# EAGLE board clock12 (EAGLE 7.7.0)
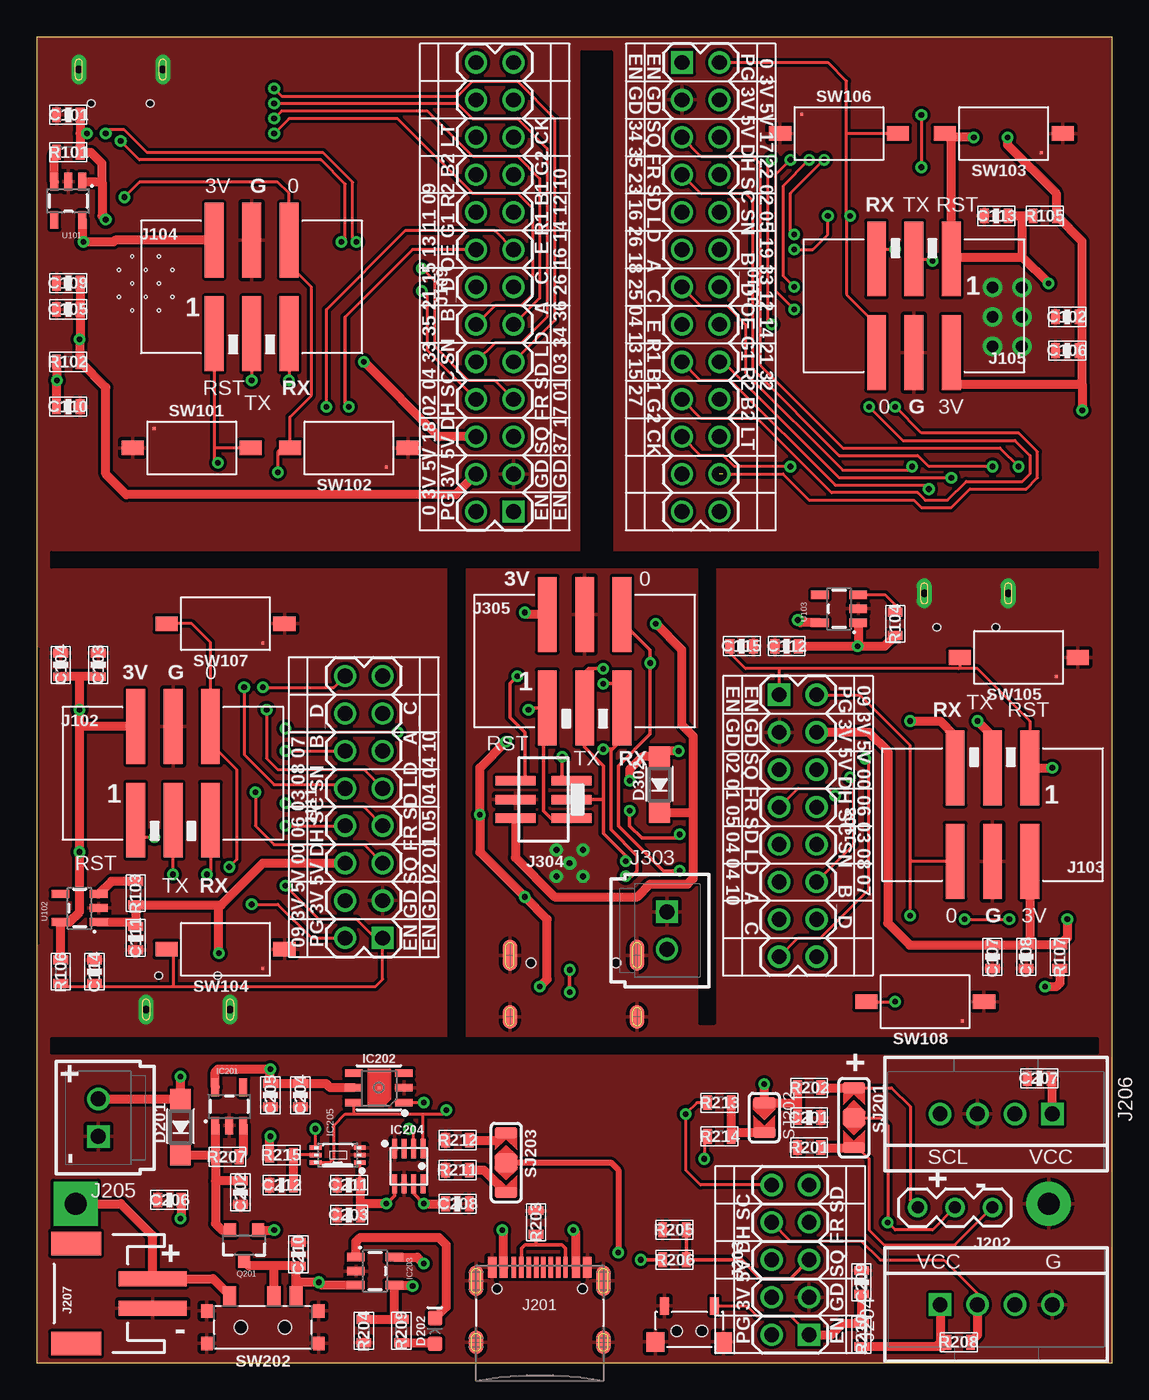
[diagram p3: board, top side]
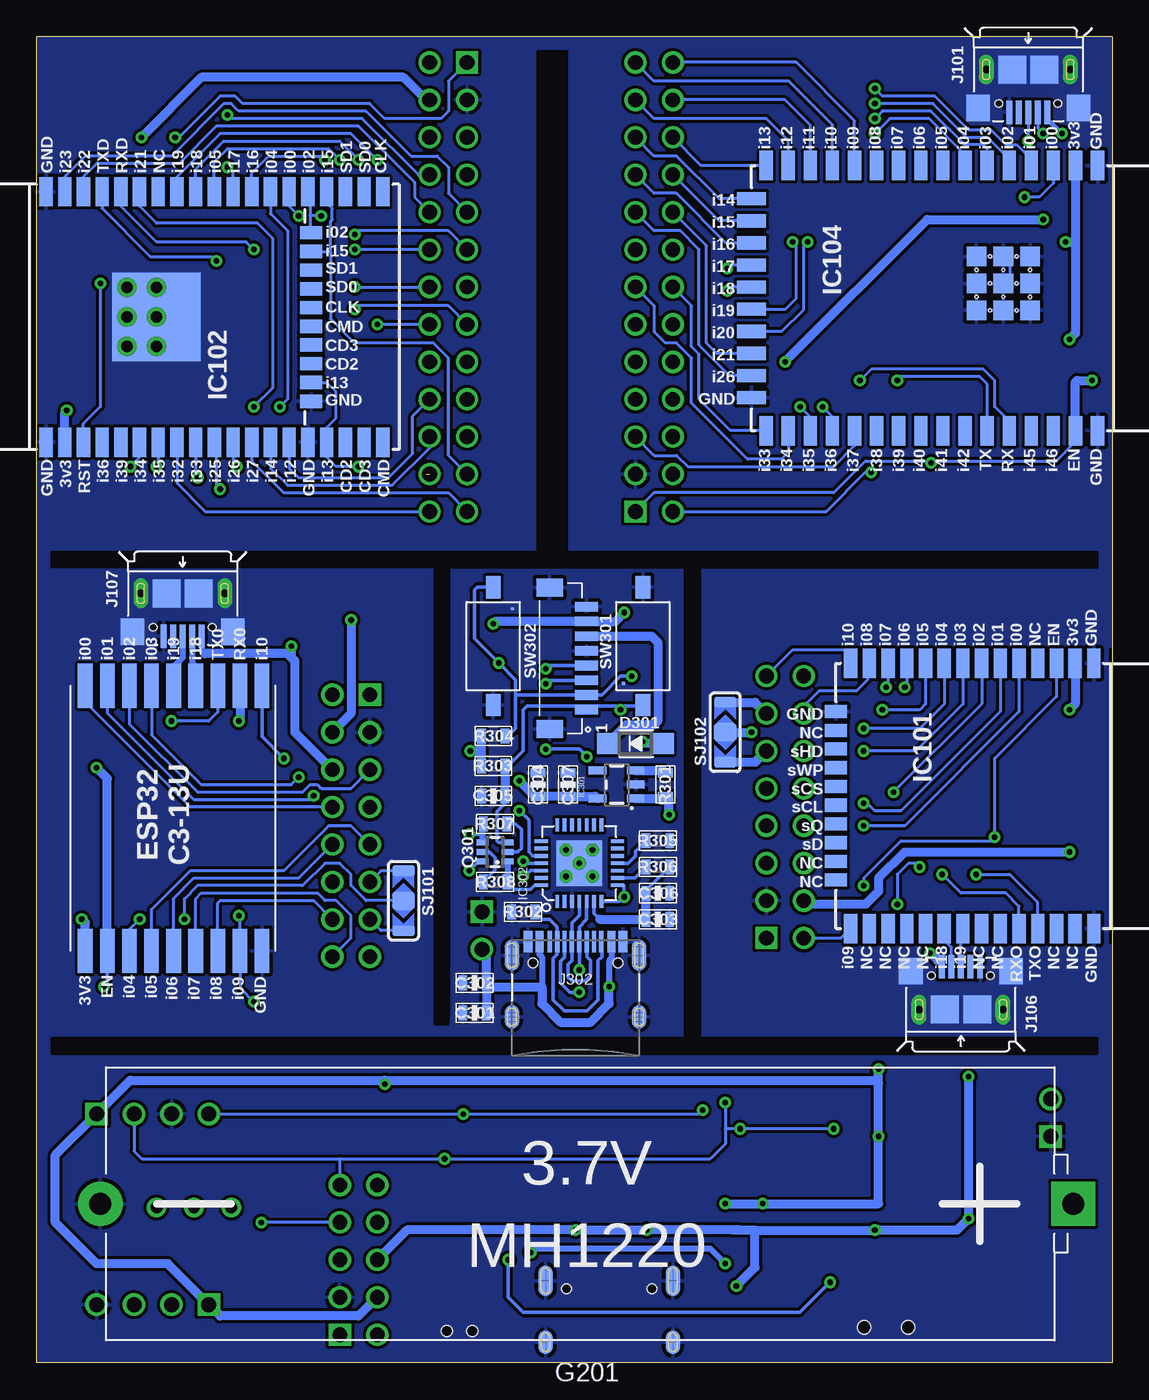
[diagram p4: board, bottom side, seen from below]

Size 73 x 90 mm. Coordinates in mm from the lower left corner, seen from the top.
Outline: 0,90 0,0 73,0 73,90 0,90
Copper layers (1*16): Top 0.035mm / dielectric 1.5mm / Bottom 0.035mm
Design rules "default *": minimum track width 8mil, minimum drill 15mil, track to track 8mil, track to pad 8mil, pad to pad 8mil, via to via 8mil, smd to smd 8mil, copper to edge 1mil, drill to drill 8mil, minimum pad ring 10mil, minimum via ring 8mil, stop-mask expansion 4mil, vias tented up to drill 20mil, thermal gap 10mil
Net classes: 0 default: clearance 0.205 mm; 1 power: width 0.406 mm

## Footprints (pad centres in the part's own frame; a part is rotated, then mirrored left to right if it is on the bottom)
0603-CAP = smd 0.6 x 1: 1 -0.8,0; 2 0.8,0
SOD123 = smd 1.4 x 1.4: A 1.9,0; C -1.9,0
LED-0603 = smd 1 x 1: A -0.877,0; C 0.877,0
BATTERY-LI-MH12210 = drill 1.5 pad 3 square: BAT+ -33.02,0 | drill 1.5 pad 3: BAT- 33.02,0
ESP32C3-S = smd 2 x 0.9: 1 -9,7.5; 2 -9,6.23; 3 -9,4.96; 4 -9,3.69; 5 -9,2.42; 6 -9,1.15; 7 -9,-0.12; 8 -9,-1.39; 9 -9,-2.66; 10 -9,-3.93; 11 -9,-5.2; 12 -9,-6.47; 13 -9,-7.74; 14 -9,-9.01; 25 9,-9.01; 26 9,-7.74; 27 9,-6.47; 28 9,-5.2; 29 9,-3.93; 30 9,-2.66; 31 9,-1.39; 32 9,-0.12; 33 9,1.15; 34 9,2.42; 35 9,3.69; 36 9,4.96; 37 9,6.23; 38 9,7.5 | smd 0.9 x 1.5: 39 -5.725,-10; 40 -4.445,-10; 41 -3.175,-10; 42 -1.905,-10; 43 -0.635,-10; 44 0.635,-10; 45 1.905,-10; 46 3.175,-10; 47 4.445,-10; 48 5.715,-10
ESP32-WROOVER/WROOM = smd 2 x 0.9: 1 -8.5,7.5; 2 -8.5,6.23; 3 -8.5,4.96; 4 -8.5,3.69; 5 -8.5,2.42; 6 -8.5,1.15; 7 -8.5,-0.12; 8 -8.5,-1.39; 9 -8.5,-2.66; 10 -8.5,-3.93; 11 -8.5,-5.2; 12 -8.5,-6.47; 13 -8.5,-7.74; 14 -8.5,-9.01; 15 -8.5,-10.28; 16 -8.5,-11.55; 17 -8.5,-12.82; 18 -8.5,-14.09; 19 -8.5,-15.36; 20 8.5,-15.36; 21 8.5,-14.09; 22 8.5,-12.82; 23 8.5,-11.55; 24 8.5,-10.28; 25 8.5,-9.01; 26 8.5,-7.74; 27 8.5,-6.47; 28 8.5,-5.2; 29 8.5,-3.93; 30 8.5,-2.66; 31 8.5,-1.39; 32 8.5,-0.12; 33 8.5,1.15; 34 8.5,2.42; 35 8.5,3.69; 36 8.5,4.96; 37 8.5,6.23; 38 8.5,7.5 | smd 0.9 x 1.5: 39 -5.725,-10.5; 40 -4.445,-10.5; 41 -3.175,-10.5; 42 -1.905,-10.5; 43 -0.635,-10.5; 44 0.635,-10.5; 45 1.905,-10.5; 46 3.175,-10.5; 47 4.445,-10.5; 48 5.715,-10.5 | smd 6 x 6: GND 0,0 | drill 0.8: PAD$1 -2,2; PAD$4 0,2; PAD$5 2,2; PAD$7 -2,0; PAD$8 0,0; PAD$9 2,0
ESP32C3-13U = smd 3 x 1: 3V3 -9,5.6; EN -9,4.1; GND -9,-6.4; IO0 9,5.6; IO1 9,4.1; IO2 9,2.6; IO3 9,1.1; IO4 -9,2.6; IO5 -9,1.1; IO6 -9,-0.4; IO7 -9,-1.9; IO8 -9,-3.4; IO9 -9,-4.9; IO10 9,-6.4; IO18 9,-1.9; IO19 9,-0.4; RX0 9,-4.9; TX0 9,-3.4
ESP-12K = smd 2 x 0.9: GND1 -9,7.5; GND3 9,7.5; I00 -9,4.5; I01 -9,3; I02 -9,1.5; I03 -9,0; I04 -9,-1.5; I05 -9,-3; I06 -9,-4.5; I07 -9,-6; I08 -9,-7.5; I09 -9,-9; I10 -9,-10.5; I11 -9,-12; I12 -9,-13.5; I13 -9,-15; I33 9,-15; I34 9,-13.5; I35 9,-12; I36 9,-10.5; I37 9,-9; I38 9,-7.5; I39 9,-6; I40 9,-4.5; I41 9,-3; I42 9,-1.5; I45 9,3; I46 9,4.5; RST 9,6; RX 9,1.5; TX 9,0; VCC -9,6 | smd 0.9 x 2: GND2 6.75,-16; I14 -6.75,-16; I15 -5.25,-16; I16 -3.75,-16; I17 -2.25,-16; I18 -0.75,-16; I19 0.75,-16; I20 2.25,-16; I21 3.75,-16; I26 5.25,-16 | smd 1.33 x 1.33: PAD0 -2.825,2.925; PAD1 -1,2.925; PAD2 0.825,2.925; PAD3 -2.825,1.1; PAD4 -1,1.1; PAD5 0.825,1.1; PAD6 -2.825,-0.725; PAD7 -1,-0.725; PAD8 0.825,-0.725 | hole 0.2: -2.825,0.188; -1,0.188; -2.825,2.013; 0.825,0.188; 0.825,2.013; -1,2.013; -1.913,-0.725; -1.913,1.1; -1.913,2.925; -0.087,-0.725; -0.087,1.1; -0.087,2.925
SOT23-5 = smd 0.55 x 1.2: 1 -0.95,-1.3; 2 0,-1.3; 3 0.95,-1.3; 4 0.95,1.3; 5 -0.95,1.3
DFN-6-3X3-SI7021 = smd 0.2 x 0.2: 7 0,0 | smd 1.2 x 0.5: DATA 1.7,-1; GND 1.7,0; NC@3 1.7,1; NC@4 -1.7,1; SCK -1.7,-1; VDD -1.7,0
LGA-8-2.5X2.5 = smd 0.35 x 1.3: 1 -0.975,1.2; 2 -0.325,1.2; 3 0.325,1.2; 4 0.975,1.2; 5 0.975,-1.2; 6 0.325,-1.2; 7 -0.325,-1.2; 8 -0.975,-1.2
WSOF6L = smd 0.3 x 0.8: 1 -0.5,-1.5; 2 0,-1.5; 3 0.5,-1.5; 4 0.5,1.5; 5 0,1.5; 6 -0.5,1.5
QFN28G_0.5-5X5MM = smd 0.9 x 0.254: 1 -2.59,1.5; 2 -2.59,1; 3 -2.59,0.5; 4 -2.59,0; 5 -2.59,-0.5; 6 -2.59,-1; 7 -2.59,-1.5; 15 2.59,-1.5; 16 2.59,-1; 17 2.59,-0.5; 18 2.59,0; 19 2.59,0.5; 20 2.59,1; 21 2.59,1.5 | smd 0.254 x 0.9: 8 -1.5,-2.59; 9 -1,-2.59; 10 -0.5,-2.59; 11 0,-2.59; 12 0.5,-2.59; 13 1,-2.59; 14 1.5,-2.59; 22 1.5,2.59; 23 1,2.59; 24 0.5,2.59; 25 0,2.59; 26 -0.5,2.59; 27 -1,2.59; 28 -1.5,2.59 | smd 3.1 x 3.1: 29 0,0 | drill 0.4: HG1 -0.9,0.9; HG2 -0.9,-0.9; HG3 0.9,-0.9; HG4 0.9,0.9; HG5 0,0
USB-B-MICRO-SMD_MY = smd 1.6 x 0.4: D+ -4.4,0; D- -4.4,-0.65; GND -4.4,1.3; ID -4.4,0.65; VBUS -4.4,-1.3 | drill 0.5 long: SH@1 -1.5,-2.85; SH@2 -1.5,2.85 | smd 1.9 x 1.9: SH@3 -1.5,-1.1; SH@4 -1.5,1.1 | smd 1.8 x 1.6: SH@5 -4.1,-3.4; SH@6 -4.1,3.4 | hole 0.5: -3.8,-2; -3.8,2
2X03_SMT = smd 1.27 x 5.08: 1 -2.54,-3.175; 2 -2.54,3.175; 3 0,-3.175; 4 0,3.175; 5 2.54,-3.175; 6 2.54,3.175
2X8 = drill 1 square: 1 -8.89,-1.27 | drill 1: 2 -8.89,1.27; 3 -6.35,-1.27; 4 -6.35,1.27; 5 -3.81,-1.27; 6 -3.81,1.27; 7 -1.27,-1.27; 8 -1.27,1.27; 9 1.27,-1.27; 10 1.27,1.27; 11 3.81,-1.27; 12 3.81,1.27; 13 6.35,-1.27; 14 6.35,1.27; 15 8.89,-1.27; 16 8.89,1.27
2X13 = drill 1 square: 1 -15.24,-1.27 | drill 1: 2 -15.24,1.27; 3 -12.7,-1.27; 4 -12.7,1.27; 5 -10.16,-1.27; 6 -10.16,1.27; 7 -7.62,-1.27; 8 -7.62,1.27; 9 -5.08,-1.27; 10 -5.08,1.27; 11 -2.54,-1.27; 12 -2.54,1.27; 13 0,-1.27; 14 0,1.27; 15 2.54,-1.27; 16 2.54,1.27; 17 5.08,-1.27; 18 5.08,1.27; 19 7.62,-1.27; 20 7.62,1.27; 21 10.16,-1.27; 22 10.16,1.27; 23 12.7,-1.27; 24 12.7,1.27; 25 15.24,-1.27; 26 15.24,1.27
USB-C-16P = smd 0.3 x 1.45: A5 -1.25,0; A6 -0.25,0; A7 0.25,0; A8 1.25,0; B5 1.75,0; B6 0.75,0; B7 -0.75,0; B8 -1.75,0 | smd 0.6 x 1.45: GND -3.225,0; GND2 3.225,0 | smd 1 x 2.1: SHLD1 -4.32,-0.915; SHLD2 4.32,-0.915 | smd 1 x 2.1 bottom: SHLD3 -4.32,-0.915; SHLD4 4.32,-0.915 | smd 1 x 1.6: SHLD5 -4.32,-5.095; SHLD8 4.32,-5.095 | smd 1 x 1.6 bottom: SHLD6 -4.32,-5.095; SHLD7 4.32,-5.095 | smd 0.55 x 1.45: VBUS1 -2.45,0; VBUS2 2.45,0 | hole 0.65: -2.89,-1.445; 2.89,-1.445
1X03 = drill 0.813: 1 0,0; 2 2.54,0; 3 5.08,0
2X05 = drill 1 square: 1 -5.08,-1.27 | drill 1: 2 -5.08,1.27; 3 -2.54,-1.27; 4 -2.54,1.27; 5 0,-1.27; 6 0,1.27; 7 2.54,-1.27; 8 2.54,1.27; 9 5.08,-1.27; 10 5.08,1.27
70543-04 = drill 1.016 square: 1 -3.81,0 | drill 1.016: 2 -1.27,0; 3 1.27,0; 4 3.81,0
70543-02 = drill 1.016 square: 1 -1.27,0 | drill 1.016: 2 1.27,0
JST-2-SMD = smd 1 x 4.6: 1 -1,-3.7; 2 1,-3.7 | smd 1.6 x 3.4: NC1 -3.4,1.5; NC2 3.4,1.5
JST-SH-8-SMT-1MM = smd 0.66 x 1.55: P$1 0,-1; P$2 1,-1; P$3 2,-1; P$4 3,-1; P$5 4,-1; P$6 5,-1; P$7 6,-1; P$8 7,-1 | smd 1.2 x 1.8: P$9 -1.3,1.5; P$10 8.3,1.5
2X03_1.27MM_SMT = smd 0.65 x 2.7: 1 -1.27,-1.9; 2 -1.27,1.9; 3 0,-1.9; 4 0,1.9; 5 1.27,-1.9; 6 1.27,1.9
SOT23-3@1 = smd 0.8 x 0.9: 1 -0.95,-1; 2 0.95,-1; 3 0,1.1
SOT363_PHILIPS = smd 0.4 x 0.8: 1 -0.65,-0.85; 2 0,-0.85; 3 0.65,-0.85; 4 0.65,0.85; 5 0,0.85; 6 -0.65,0.85
R0603 = smd 0.6 x 1: 1 -0.8,0; 2 0.8,0
MICROBUILDER_SOLDERJUMPER_ARROW_NOPASTE_3 = smd 1.27 x 1.524: 1 0,0 | smd 0.762 x 1.524: 2 2.032,0; 3 -2.032,0
MICROBUILDER_SOLDERJUMPER_ARROW_NOPASTE = smd 0.762 x 1.524: 1 -1.016,0; 2 1.016,0
MICROPUSH-BUT_TOP = smd 1.5 x 1: A -4,0; B 4,0 | smd 0.2 x 0.2: SH0 -2.54,1.31
MICROPUSH-BUT_ANG = smd 0.6 x 1.2: A -1.7,-1.7; B 1.7,-1.7 | smd 1.2 x 1.3: SH0 -2.3,0.75; SH3 2.3,0.75 | hole 0.75: -0.85,0; 0.85,0
SWITCH-SMD-L6.7X2.7X3.2MM = smd 1.25 x 0.9: A 2.15,2.25; B 2.15,-2.25; COM 2.15,-0.75 | smd 0.9 x 0.8: SS1 -1.1,-3.8; SS2 1.1,-3.8; SS3 1.1,3.8; SS4 -1.1,3.8 | hole 0.9: 0,-1.5; 0,1.5

## Placement (x,y rotation side)
C101  10u  [0603-CAP]  2.14,84.7 180 top
C102  10u  [0603-CAP]  69.96,70.99 0 top
C103  0.1u  [0603-CAP]  4.17,47.37 270 top
C104  10u  [0603-CAP]  1.63,47.37 270 top
C105  10u  [0603-CAP]  2.14,71.5 0 top
C106  0.1u  [0603-CAP]  69.96,68.7 0 top
C107  0.1u  [0603-CAP]  64.88,27.55 90 top
C108  10u  [0603-CAP]  67.16,27.55 90 top
C109  0.1u  [0603-CAP]  2.14,73.27 0 top
C110  1u  [0603-CAP]  2.14,64.89 0 top
C111  10u  [0603-CAP]  6.71,28.82 270 top
C112  10u  [0603-CAP]  50.91,48.64 180 top
C113  1u  [0603-CAP]  65.13,77.85 180 top
C114  1u  [0603-CAP]  3.92,26.54 90 top
C115  1u  [0603-CAP]  47.86,48.64 0 top
C201  0.1u  [0603-CAP]  52.43,16.63 0 top
C202  1u  [0603-CAP]  13.82,11.55 270 top
C203  0.1u  [0603-CAP]  21.19,10.03 0 top
C204  1u  [0603-CAP]  17.89,18.16 270 top
C205  10u  [0603-CAP]  15.85,18.16 270 top
C206  10u  [0603-CAP]  9,11.04 180 top
C207  0.1u  [0603-CAP]  68.05,19.3 0 top
C208  0.1u  [0603-CAP]  28.55,10.79 180 top
C209  1u  [0603-CAP]  55.99,5.46 90 top
C210  10u  [0603-CAP]  17.76,7.36 90 top
C211  0.1u  [0603-CAP]  21.19,12.06 0 top
C212  0.1u  [0603-CAP]  16.62,12.06 180 top
C301  22u  [0603-CAP]  43.29,23.74 180 bottom
C302  0.1u  [0603-CAP]  43.29,25.78 180 bottom
C303  0.1u  [0603-CAP]  30.84,30.09 180 bottom
C304  22u  [0603-CAP]  38.97,39.24 90 bottom
C305  1u  [0603-CAP]  42.02,38.48 0 bottom
C306  1u  [0603-CAP]  30.84,31.87 180 bottom
C307  0.1u  [0603-CAP]  36.94,39.24 90 bottom
D201  1N5819  [SOD123]  9.76,16 90 top
D202  CRG  [LED-0603]  27.03,2.15 90 top
D301  IN5819  [SOD123]  32.36,42.03 0 bottom
D302  IN5819  [SOD123]  42.27,39.24 90 top
G201  BATTERY-LI-MH12210  [BATTERY-LI-MH12210]  35.67,10.79 180 bottom
IC101  ESP32C3  [ESP32C3-S]  8.74,38.48 270 bottom
IC102  ESP32  [ESP32-WROOVER/WROOM]  64.88,70.99 90 bottom
IC103  ESP32C3-MODULE13U  [ESP32C3-13U]  64.11,36.95 90 bottom
IC104  ESP32S2  [ESP-12K]  8.49,72.26 270 bottom
IC201  AP2112  [SOT23-5]  13.06,17.39 0 top
IC202  SI7021  [DFN-6-3X3-SI7021]  23.22,18.66 0 top
IC203  MCP73831  [SOT23-5]  22.97,6.22 270 top
IC204  BME280  [LGA-8-2.5X2.5]  25.25,13.33 0 top
IC205  BH1750  [WSOF6L]  20.43,14.09 90 top
IC301  AP2112  [SOT23-5]  33.63,39.24 90 bottom
IC302  CP2102  [QFN28G_0.5-5X5MM]  36.17,33.9 90 bottom
J101  [USB-B-MICRO-SMD_MY]  5.69,89.28 90 bottom
J102  COM  [2X03_SMT]  9.25,40 0 top
J103  COM  [2X03_SMT]  64.88,37.21 180 top
J104  COM  [2X03_SMT]  14.58,73.02 0 top
J105  COM  [2X03_SMT]  59.54,71.75 180 top
J106  [USB-B-MICRO-SMD_MY]  10.27,22.47 270 bottom
J107  [USB-B-MICRO-SMD_MY]  63.1,53.72 90 bottom
J108  [2X8]  51.67,36.44 270 top
J109  [2X13]  31.09,73.02 90 top
J110  [2X13]  45.06,73.02 270 top
J111  [2X8]  22.2,37.71 90 top
J201  [USB-C-16P]  34.14,6.47 0 top
J202  FR  [1X03]  64.88,10.54 180 top
J203  [2X05]  51.16,6.98 90 top
J204  DHT22  [70543-04]  65.13,3.93 0 top
J205  +5V  [70543-02]  4.17,16.63 90 top
J206  AM2320  [70543-04]  65.13,16.89 180 top
J207  LiPo  [JST-2-SMD]  4.17,4.69 90 top
J301  PROG  [JST-SH-8-SMT-1MM]  36.68,44.32 90 bottom
J302  [USB-C-16P]  36.43,28.57 0 bottom
J303  +5V  [70543-02]  42.78,29.33 270 top
J304  COM1  [2X03_1.27MM_SMT]  34.4,38.22 90 top
J305  COM2  [2X03_SMT]  37.19,47.62 0 top
Q201  2301  [SOT23-3@1]  14.08,8 180 top
Q301  [SOT363_PHILIPS]  41.89,34.67 90 bottom
R101  100k  [R0603]  2.14,82.16 180 top
R102  10k  [R0603]  2.14,67.94 0 top
R103  100k  [R0603]  6.71,31.87 90 top
R104  100k  [R0603]  58.27,50.16 90 top
R105  10k  [R0603]  68.43,77.85 0 top
R106  10k  [R0603]  1.63,26.54 90 top
R107  10k  [R0603]  69.45,27.55 90 top
R201  47k  [R0603]  52.43,14.6 0 top
R202  47k  [R0603]  52.43,18.66 180 top
R203  5.1k  [R0603]  33.89,9.52 270 top
R204  10k  [R0603]  22.2,2.15 90 top
R205  27k  [R0603]  43.29,9.01 0 top
R206  100k  [R0603]  43.29,6.98 180 top
R207  100k  [R0603]  12.93,13.96 0 top
R208  1k  [R0603]  62.59,1.39 0 top
R209  1k  [R0603]  24.74,2.15 270 top
R210  10k  [R0603]  55.99,1.9 270 top
R211  2k  [R0603]  28.55,13.08 0 top
R212  10k  [R0603]  28.55,15.11 180 top
R213  3k3  [R0603]  46.33,17.65 180 top
R214  3k3  [R0603]  46.33,15.36 180 top
R215  1k  [R0603]  16.62,14.09 0 top
R301  100k  [R0603]  30.33,39.24 90 bottom
R302  5.1k  [R0603]  39.98,30.6 0 bottom
R303  10k  [R0603]  42.02,40.51 0 bottom
R304  10k  [R0603]  42.02,42.54 180 bottom
R305  10k  [R0603]  30.84,35.43 0 bottom
R306  4.7k  [R0603]  30.84,33.65 0 bottom
R307  2k  [R0603]  41.89,36.57 0 bottom
R308  2k  [R0603]  41.89,32.63 180 bottom
SJ101  L/W  [MICROBUILDER_SOLDERJUMPER_ARROW_NOPASTE_3]  48.11,31.36 270 bottom
SJ102  L/W  [MICROBUILDER_SOLDERJUMPER_ARROW_NOPASTE_3]  26.27,42.79 90 bottom
SJ201  PR NEG/POS  [MICROBUILDER_SOLDERJUMPER_ARROW_NOPASTE_3]  55.48,16.63 270 top
SJ202  i2c_pullup  [MICROBUILDER_SOLDERJUMPER_ARROW_NOPASTE]  49.38,16.63 270 top
SJ203  1/5  [MICROBUILDER_SOLDERJUMPER_ARROW_NOPASTE_3]  31.86,13.58 270 top
SW101  RST  [MICROPUSH-BUT_TOP]  10.52,62.1 0 top
SW102  PRG  [MICROPUSH-BUT_TOP]  21.19,62.1 180 top
SW103  RST  [MICROPUSH-BUT_TOP]  65.64,83.43 180 top
SW104  RST  [MICROPUSH-BUT_TOP]  12.81,28.06 180 top
SW105  RST  [MICROPUSH-BUT_TOP]  66.65,47.87 180 top
SW106  PRG  [MICROPUSH-BUT_TOP]  54.46,83.43 0 top
SW107  PRG  [MICROPUSH-BUT_TOP]  12.81,50.16 180 top
SW108  PRG  [MICROPUSH-BUT_TOP]  60.3,24.51 180 top
SW201  MICROSWITCH-BUTTONANGLE  [MICROPUSH-BUT_ANG]  44.3,2.15 180 top
SW202  BAT ON  [SWITCH-SMD-L6.7X2.7X3.2MM]  15.35,2.41 90 top
SW301  RST  [MICROPUSH-BUT_TOP]  31.86,48.64 90 bottom
SW302  PRG  [MICROPUSH-BUT_TOP]  42.02,48.64 270 bottom
U101  AP2112  [SOT23-5]  2.14,78.86 180 top
U102  AP2112  [SOT23-5]  2.9,30.86 90 top
U103  AP2112  [SOT23-5]  54.46,51.18 90 top

## Tracks (layer width: path | path; a pad name or v marks a point on that pad's centre or on a via)
1EN  (via drill 0.38)
  Top 0.203: 11.79,70.1 J104.1 12.04,62.1 | 12.04,62.1 12.04,61.34 v12.3,61.08 | SW101.B 12.04,62.1
  Top 0.61: R102.1 1.34,66.71 v1.38,66.67 1.34,66.63 C110.1
  Bottom 0.203: J109.1 31.09,59.05 18.9,59.05 16.74,61.21 12.3,61.21 | 12.3,61.21 3.79,61.21 2.49,62.51 IC104.RST | v12.3,61.08 12.3,61.21
  Bottom 0.61: v1.38,66.67 2.39,66.67 2.49,66.57 IC104.RST
1EN_P
  Top 0.61: U101.3 1.19,82.01 R101.2
1IO0  (via drill 0.38)
  Top 0.203: v5.95,79.12 6.96,80.13 16.36,80.13 17.12,79.37 J104.6 17.12,74.54 18.65,73.02 18.65,65.65 17.19,64.19 SW102.B 16.62,62.1 16.36,61.84 v16.36,60.45
  Bottom 0.203: J109.2 19.41,57.78 16.74,60.45 v16.36,60.45 | IC104.I00 3.99,80.06 4.93,79.12 v5.95,79.12
1IO1  (via drill 0.38)
  Top 0.203: v16.11,86.48 16.62,85.97 28.55,85.97 29.57,86.99 32.62,86.99 35.16,84.45 35.16,70.73 J109.9
  Bottom 0.203: IC104.I01 5.44,81.31 5.44,81.66 6.46,82.67 7.22,82.67 8.23,83.69 9.76,83.69 12.04,85.97 15.6,85.97 v16.11,86.48
1IO2  (via drill 0.38)
  Top 0.203: J109.10 31.09,69.21 32.87,69.21 34.65,70.99 34.65,82.42 32.62,84.45 29.57,84.45 28.55,85.47 v16.11,85.47
  Bottom 0.203: IC104.I02 6.99,81.68 8.49,83.18 9.89,83.18 12.17,85.47 v16.11,85.47
1IO3  (via drill 0.38)
  Top 0.203: v16.11,84.45 16.62,84.96 26.52,84.96 29.57,81.91 32.62,81.91 34.14,80.39 34.14,72.26 J109.11
  Bottom 0.203: IC104.I03 8.49,82.42 8.74,82.67 10.01,82.67 12.3,84.96 15.6,84.96 v16.11,84.45
1IO4  (via drill 0.38)
  Top 0.203: v16.11,83.43 17.12,84.45 24.49,84.45 29.57,79.37 32.62,79.37 33.63,78.35 33.63,72.51 32.87,71.75 31.09,71.75 J109.12
  Bottom 0.203: IC104.I04 9.99,82.01 12.43,84.45 15.09,84.45 v16.11,83.43
1IO9
  Bottom 0.203: IC104.I09 17.49,84.31 21.44,88.26 J109.26
1IO10
  Bottom 0.203: IC104.I10 18.99,84.03 21.95,86.99 31.09,86.99 J109.25
1IO11
  Bottom 0.203: IC104.I11 20.49,84 22.2,85.72 J109.24
1IO12
  Bottom 0.203: IC104.I12 21.99,82.96 23.47,84.45 31.09,84.45 J109.23
1IO13
  Bottom 0.203: IC104.I13 27.9,81.26 J109.22
1IO14
  Bottom 0.203: IC104.I14 26.67,79.01 29.57,81.91 31.09,81.91 J109.21
1IO15
  Bottom 0.203: IC104.I15 26.69,77.51 J109.20
1IO16
  Bottom 0.203: IC104.I16 26.21,76.01 29.57,79.37 31.09,79.37 J109.19
1IO17  (via drill 0.38)
  Top 0.203: J109.7 31.09,66.67 29.32,66.67 27.03,68.96 27.03,73.4 v26.14,74.29
  Bottom 0.203: IC104.I17 25.92,74.51 v26.14,74.29
1IO18  (via drill 0.38)
  Top 0.203: J109.8 26.52,68.7 26.52,72.38 v26.14,72.77
  Bottom 0.203: IC104.I18 25.9,73.01 v26.14,72.77
1IO19  (via drill 0.38)
  Top 0.203: v21.7,76.07 21.44,76.32 21.44,80.13 19.41,82.16 7.47,82.16 5.95,83.69 4.93,83.69 v4.68,83.43
  Bottom 0.203: J101.D- 5.04,83.8 v4.68,83.43 | IC104.I19 24.48,71.5 22.2,71.5 21.44,72.26 21.44,75.81 v21.7,76.07
1IO20  (via drill 0.38)
  Top 0.203: v20.68,76.07 20.93,76.32 20.93,80 19.28,81.66 6.96,81.66 v5.69,82.93
  Bottom 0.203: J101.D+ v5.69,82.93 | IC104.I20 22.42,70.01 20.93,71.5 20.93,75.81 v20.68,76.07
1IO21
  Bottom 0.203: IC104.I21 26.84,68.51 27.54,69.21 27.54,75.81 J109.18
1IO26
  Bottom 0.203: J109.17 31.09,76.83 29.32,76.83 28.05,75.56 28.05,69.08 25.97,67.01 IC104.I26
1IO33
  Bottom 0.203: 23.49,63.61 IC104.I33 23.47,63.27 25.92,63.27 28.05,65.4 28.05,68.45 28.55,68.96 28.55,71.75 J109.14
1IO34
  Bottom 0.203: IC104.I34 21.99,61.81 22.46,61.34 24.74,61.34 28.55,65.15 28.55,68.19 29.57,69.21 30.33,69.21 31.09,69.97 31.09,71.75 J109.13
1IO35  (via drill 0.38)
  Top 0.203: J109.16 25.51,75.56 20.93,70.99
  Top 0.254: 20.93,70.99 20.93,65.15 v21.19,64.89
  Bottom 0.203: IC104.I35 20.49,64.19 v21.19,64.89
1IO36  (via drill 0.38)
  Top 0.203: v19.66,64.89 19.66,71.5 25,76.83 31.09,76.83 J109.15
  Bottom 0.203: IC104.I36 18.99,64.22 v19.66,64.89
1IO37
  Bottom 0.203: J109.5 31.09,61.59 29.57,61.59 28.81,60.83 18.9,60.83 17.49,62.24 IC104.I37
1RX0  (via drill 0.38)
  Top 0.203: J104.5 v17.12,66.67
  Bottom 0.203: IC104.RX 6.99,63.9 7.98,64.89 7.98,66.67 8.74,67.43 16.36,67.43 v17.12,66.67
1TX0  (via drill 0.38)
  Top 0.203: J104.3 v14.58,66.67
  Bottom 0.203: IC104.TX 8.49,66.42 9,66.92 14.33,66.92 v14.58,66.67
2D+
  Bottom 0.406: J107.D+ 63.1,47.87 63.71,47.26 IC103.IO19
2D-
  Bottom 0.406: J107.D- 62.45,47.48 62.21,47.24 IC103.IO18
2EN  (via drill 0.38)
  Top 0.203: J103.1 67.42,43.56 63.86,47.11 62.59,47.11 | 62.59,47.11 50.4,47.11 | 50.4,47.11 48.11,47.11 47.1,48.13 47.1,48.6 C115.1 | J108.1 50.4,47.11 | SW105.B 62.65,47.18 62.59,47.11
  Top 0.61: J103.1 v68.94,40.38 | R107.1 69.45,25.78 69.19,25.52 v68.43,25.52
  Bottom 0.254: IC103.EN 68.21,25.74 v68.43,25.52
  Bottom 0.61: IC103.EN 68.21,39.66 v68.94,40.38
2EN_P
  Top 0.203: R104.2 58.27,51.43 57.58,52.13 U103.3
2IO0
  Bottom 0.203: IC103.IO0 69.71,44.84 62.59,37.71 J108.8
2IO1  (via drill 0.38)
  Top 0.203: J108.7 51.67,38.98 53.7,38.98 v54.21,38.48
  Bottom 0.203: IC103.IO1 68.21,44.1 62.34,38.22 54.46,38.22 v54.21,38.48
2IO2
  Bottom 0.203: IC103.IO2 66.71,43.36 62.08,38.73 54.97,38.73 54.46,39.24 53.95,39.24 53.7,38.98 51.67,38.98 J108.5
2IO3  (via drill 0.38)
  Top 0.203: J108.12 55.48,35.17 55.48,39.49 v55.22,39.75
  Bottom 0.203: IC103.IO3 65.21,42.62 61.83,39.24 55.73,39.24 v55.22,39.75
2IO4  (via drill 0.38)
  Top 0.203: v62.97,30.09 v66.02,30.09
  Bottom 0.203: IC103.IO4 66.71,29.4 v66.02,30.09 | v62.97,30.09 62.97,31.49 62.08,32.38 54.97,32.38 53.45,33.9 52.43,33.9 51.67,33.14 51.67,32.38 50.65,31.36 SJ101.1
2IO5
  Bottom 0.203: J108.9 51.67,36.44 53.19,36.44 56.24,33.4 62.59,33.4 65.21,30.77 IC103.IO5
2IO6
  Bottom 0.203: J108.10 55.22,32.89 62.34,32.89 63.71,31.51 IC103.IO6
2IO7
  Bottom 0.203: IC103.IO7 62.21,31.49 61.83,31.87 53.95,31.87 53.45,31.36 52.68,31.36 51.67,30.35 51.67,28.82 J108.16
2IO8
  Bottom 0.203: IC103.IO8 60.71,31.21 60.56,31.36 54.21,31.36 J108.14
2IO9  (via drill 0.38)
  Top 0.203: v59.29,30.35 59.29,34.16 | 59.29,34.16 59.29,41.91 55.86,45.33 J108.2 | J103.6 59.41,34.03 59.29,34.16 | SW108.B v58.27,24.51
  Bottom 0.203: v59.29,30.35 59.21,30.27 IC103.IO9 59.21,25.45 v58.27,24.51
2IO10  (via drill 0.38)
  Top 0.203: J108.15 51.67,28.82 53.19,28.82 56.49,32.13 56.49,40.76 v56.24,41.02
  Bottom 0.254: IC103.IO10 57.71,42.49 v56.24,41.02
2RX0  (via drill 0.38)
  Top 0.61: v59.29,43.56 61.32,43.56 62.34,42.54 J103.5
  Bottom 0.203: 59.21,43.63 v59.29,43.56
  Bottom 0.61: IC103.RX0 59.21,43.63
2TX0  (via drill 0.38)
  Top 0.61: J103.3 64.88,42.54 v63.86,43.56
  Bottom 0.203: IC103.TX0 60.71,44.16 61.32,43.56 v63.86,43.56
3D+
  Bottom 0.203: J106.D+ 10.27,29.34 IC101.31
3D-
  Bottom 0.203: J106.D- 10.92,28.2 11.4,28.69 IC101.30
3EN  (via drill 0.38)
  Top 0.203: v16.87,32.38 19.16,30.09 21.7,30.09 22.97,28.82 J111.1 23.47,26.03 22.97,25.52 9.25,25.52 | 3.94,25.74 C114.1 3.92,25.52 | SW104.B 9.25,28.06 9.25,25.52 | 9.25,25.52 3.92,25.52 | 3.92,25.52 1.85,25.52 R106.1 | J102.1 6.71,35.94 6.96,35.68 v7.98,35.68
  Bottom 0.203: v16.87,32.38 16.87,32.89 14.33,35.43 8.23,35.43 v7.98,35.68 7.98,41.02 3.78,45.21 IC101.3
3EN_P
  Top 0.61: R103.2 5.07,32.67 U102.3
3IO0  (via drill 0.38)
  Top 0.203: v16.87,36.44 J111.8
  Bottom 0.203: IC101.5 6.32,44.2 14.08,36.44 v16.87,36.44
3IO1  (via drill 0.38)
  Top 0.203: J111.7 22.2,37.71 17.12,37.71 v16.87,37.97
  Bottom 0.203: v16.87,37.97 16.62,37.97 16.11,37.46 14.33,37.46 7.59,44.2 IC101.6
3IO2  (via drill 0.38)
  Top 0.203: v14.84,38.73 14.84,36.44 16.11,35.17 22.2,35.17 J111.5
  Bottom 0.203: IC101.7 8.86,44.71 v14.84,38.73
3IO3  (via drill 0.38)
  Top 0.203: v16.87,41.52 J111.12
  Bottom 0.203: IC101.8 10.13,44.71 13.31,41.52 v16.87,41.52
3IO4  (via drill 0.38)
  Top 0.203: v24.49,42.79 17.12,42.79 v16.87,43.05
  Bottom 0.203: IC101.9 11.4,44.71 13.06,43.05 v16.87,43.05
  Bottom 0.61: SJ102.1 v24.49,42.79
3IO5  (via drill 0.38)
  Top 0.203: v15.6,44.32 15.6,41.02 16.36,40.25 22.2,40.25 J111.9
  Bottom 0.203: IC101.10 12.67,44.71 13.06,44.32 v15.6,44.32
3IO6  (via drill 0.38)
  Top 0.203: v14.08,45.84 14.08,41.27 16.11,39.24 20.68,39.24 J111.10
  Bottom 0.203: IC101.11 13.94,45.98 v14.08,45.84
3IO7  (via drill 0.38)
  Top 0.203: v15.35,45.84 20.17,45.84 J111.16
  Bottom 0.203: IC101.12 15.21,45.98 v15.35,45.84
3IO8
  Bottom 0.203: J111.14 20.93,44.57 19.92,45.59 17.38,45.59 16.62,46.35 16.62,47.37 16.51,47.48 IC101.13
3IO9  (via drill 0.38)
  Top 0.203: v13.06,33.65 13.57,34.16 13.57,40.25 11.79,42.03 J102.6 11.79,48.89 10.52,50.16 SW107.B | v14.58,31.11 16.36,31.11 18.65,28.82 J111.2
  Bottom 0.203: v14.58,31.11 14.58,33.14 13.82,33.9 13.31,33.9 v13.06,33.65 | J111.2 18.4,28.82 IC101.25
3IO10
  Bottom 0.203: IC101.14 17.75,47.99 18.14,48.38 21.7,48.38 J111.15
3RX0  (via drill 0.38)
  Top 0.203: J102.5 11.79,33.4 v11.54,33.14
  Bottom 0.203: IC101.34 6.32,30.98 7.22,31.87 10.27,31.87 v11.54,33.14
3TX0  (via drill 0.38)
  Top 0.203: v9.25,33.14 J102.3
  Bottom 0.203: IC101.35 5.05,31.23 6.96,33.14 v9.25,33.14
4EN  (via drill 0.38)
  Top 0.203: 62.21,74.8 J105.1
  Top 0.61: 62.08,82.99 J105.1 62.21,75.05 66.91,75.05 | 62.08,82.99 SW103.B | C113.1 66.91,77.85 | 66.91,77.85 R105.1 | v63.61,83.18 62.27,83.18 62.08,82.99 | 66.91,75.05 v68.69,73.27 | 66.91,75.05 66.91,77.85
  Bottom 0.203: IC102.3 69.84,63.74 68.69,64.89 v68.69,73.27 | J110.1 45.06,86.99 45.06,84.96 45.57,84.45 49.38,84.45 50.4,85.47 59.03,85.47 59.54,85.97 60.56,85.97 63.35,83.18 v63.61,83.18
4IO0  (via drill 0.38)
  Top 0.203: v55.22,77.85 54.97,77.85 | 54.97,77.85 54.97,72.51 57,70.48 J105.6 | J110.2 53.7,88.26 54.97,86.99 54.97,83.43 | 54.97,77.85 54.97,83.43 | SW106.B 54.97,83.43
  Bottom 0.203: IC102.25 55.87,78.49 v55.22,77.85
4IO2  (via drill 0.38)
  Top 0.203: v51.41,75.56 52.68,75.56 53.7,76.58 v53.7,77.85
  Bottom 0.203: J110.12 v51.41,75.56 | IC102.24 54.58,79.49 54.46,79.37 54.46,77.85 | 54.46,77.85 54.46,76.79 IC102.48 | v53.7,77.85 54.46,77.85
4IO4  (via drill 0.38)
  Top 0.203: J110.19 45.06,64.13 48.87,64.13 53.95,59.05 59.8,59.05 60.3,58.54 61.83,58.54 63.1,59.81 66.91,59.81 67.42,60.32 67.42,61.59 66.4,62.61 58.78,62.61 v56.49,64.89
  Bottom 0.203: IC102.26 57.14,77.98 55.99,76.83 55.99,65.4 v56.49,64.89
4IO5  (via drill 0.38)
  Top 0.203: v52.43,81.66 50.65,79.88 50.65,73.78 v51.41,73.02
  Bottom 0.203: v51.41,73.02 J110.14 | IC102.29 60.95,81.52 60.05,82.42 53.19,82.42 v52.43,81.66
4IO12
  Bottom 0.203: IC102.14 55.87,60.71 55.22,60.07 49.13,60.07 47.48,61.72 47.48,64.26 J110.20
4IO13  (via drill 0.38)
  Top 0.203: J110.21 45.06,61.59 46.59,61.59 47.35,60.83 v51.16,60.83
  Bottom 0.203: IC102.40 53.32,66.54 52.68,65.91 52.68,64.13 53.33,63.49 IC102.16 53.33,61.47 52.68,60.83 v51.16,60.83
4IO14
  Bottom 0.203: IC102.13 57.14,60.71 55.99,59.56 48.87,59.56 46.33,62.1 J110.22
4IO15
  Bottom 0.203: J110.23 45.06,61.59 45.06,68.19 46.08,69.21 51.41,69.21 53.06,70.86 53.06,75.43 | 53.19,79.37 53.33,79.5 IC102.23 53.33,78.74 52.94,78.35 52.94,77.59 53.06,77.47 53.06,75.43 | IC102.47 53.06,75.43
4IO16  (via drill 0.38)
  Top 0.203: v51.41,76.58 51.16,76.83 51.16,79.37 v53.45,81.66
  Bottom 0.203: J110.11 45.06,76.83 51.16,76.83 v51.41,76.58 | IC102.27 58.41,80.76 57.26,81.91 53.7,81.91 v53.45,81.66
4IO17  (via drill 0.38)
  Top 0.203: v60.05,84.7 v60.05,81.15
  Bottom 0.203: J110.8 47.1,80.64 50.91,84.45 59.8,84.45 v60.05,84.7 | IC102.28 59.68,80.77 v60.05,81.15
4IO18  (via drill 0.38)
  Top 0.203: v51.16,81.66 50.14,80.64 50.14,72.77 v51.41,71.5
  Bottom 0.203: IC102.30 62.22,81.01 60.3,82.93 52.43,82.93 v51.16,81.66 | J110.15 45.06,71.75 51.16,71.75 v51.41,71.5
4IO19  (via drill 0.38)
  Top 0.203: v49.89,70.48 49.64,70.73 49.64,81.4 v49.89,81.66
  Bottom 0.203: v49.89,81.66 51.67,83.43 60.56,83.43 63.49,80.51 IC102.31 | J110.16 v49.89,70.48
4IO21  (via drill 0.38)  (1 unrouted)
  Top 0.203: v58.27,64.89 60.05,63.11 66.65,63.11 67.92,61.84 67.92,60.07 67.16,59.3 63.35,59.3 62.08,58.03 60.05,58.03 59.54,58.54 52.43,58.54 50.65,60.32 46.59,60.32
  Bottom 0.203: v58.27,64.89 57,66.16 57,76.32 58.02,77.34 64.88,77.34 66.03,78.49 IC102.33
4IO22
  Bottom 0.203: J110.10 47.35,79.12 47.35,80.13 51.16,83.94 60.81,83.94 63.35,81.4 68.94,81.4 69.84,80.51 IC102.36
4IO23
  Bottom 0.203: J110.9 45.06,79.37 45.06,81.15 45.83,81.91 47.6,81.91 50.65,84.96 59.29,84.96 59.8,85.47 60.3,85.47 63.86,81.91 69.7,81.91 71.11,80.51 IC102.37
4IO25  (via drill 0.38)
  Top 0.203: J110.17 45.06,66.67 47.1,66.67 54.21,59.56 60.3,59.56 v60.56,59.3
  Bottom 0.203: IC102.10 60.81,62.35 60.81,59.56 v60.56,59.3
4IO26  (via drill 0.38)
  Top 0.203: J110.13 45.06,71.75 46.84,71.75 48.11,70.48 48.11,67.18 54.72,60.57 59.16,60.57 v59.41,60.83
  Bottom 0.203: IC102.11 59.68,61.09 v59.41,60.83
4IO27
  Bottom 0.203: IC102.12 58.41,61.22 56.24,59.05 45.06,59.05 J110.25
4IO32
  Bottom 0.203: IC102.8 63.49,59.69 61.57,57.78 J110.26
4IO33  (via drill 0.38)
  Top 0.203: J110.18 46.59,67.94 54.46,60.07 v62.08,60.07
  Bottom 0.203: IC102.9 62.22,60.2 v62.08,60.07
4IO34  (via drill 0.38)
  Top 0.203: J110.5 45.06,81.91 48.62,81.91 49.13,81.4 49.13,67.69 54.72,62.1 65.38,62.1 v66.65,60.83
  Bottom 0.203: IC102.6 66.03,61.46 v66.65,60.83
4IO35  (via drill 0.38)
  Top 0.203: J110.7 45.06,79.37 48.11,79.37 48.62,78.86 48.62,67.43 54.46,61.59 59.8,61.59 60.56,60.83 v64.88,60.83
  Bottom 0.203: IC102.7 64.76,60.95 v64.88,60.83
4RX0  (via drill 0.38)
  Top 0.203: v58.27,75.56 57,75.56 J105.5
  Bottom 0.203: IC102.34 67.3,78.49 64.88,76.07 58.78,76.07 v58.27,75.56
4TX0  (via drill 0.38)
  Top 0.203: J105.3 60.69,74.92 v60.81,74.8
  Bottom 0.203: IC102.35 68.57,78.35 65.26,75.05 61.07,75.05 v60.81,74.8
+3V3  (via drill 0.38)
  Top 0.61: v43.58,41.52 42.66,41.52 D302.A 41.12,41.14 40.24,40.25 v40.24,39.49
  Bottom 0.61: IC301.5 35.08,38.44 C307.1 C304.1 39.18,38.44 v40.24,39.49 | R303.1 42.82,41.52 | 42.82,41.52 R304.2 42.82,42.29 | v43.58,41.52 42.82,41.52
+3V3_1  (via drill 0.38)
  Top 0.61: C109.2 C105.2 2.94,69.5 v2.9,69.46 2.94,69.43 R102.2 4.68,66.2 4.68,60.32 6.08,58.92 28.43,58.92 J109.4 | U101.5 3.09,76.13 v3.15,76.07 5.19,76.07 5.31,76.19 J104.2
  Bottom 0.61: IC104.VCC 2.49,76.07 | 2.49,76.07 2.49,69.88 v2.9,69.46 | v3.15,76.07 2.49,76.07
+3V3_2  (via drill 0.38)
  Top 0.61: J108.4 56.49,42.79 57.76,41.52 57.76,29.84 59.25,28.35 C107.2 C108.2 67.67,28.35 | U103.5 51.86,50.23 v51.67,50.41 | 67.67,28.35 R107.2 69.96,28.86 v69.96,30.09 | J103.2 67.42,28.61 67.67,28.35
  Bottom 0.61: v51.67,50.41 51.67,44.06 J108.4 | IC103.3V3 69.71,29.85 v69.96,30.09
+3V3_3  (via drill 0.38)
  Top 0.61: C103.2 2.9,46.57 | 2.9,46.57 C104.2 | 2.9,43.05 v2.9,34.67 2.9,30.6 2.2,29.91 U102.5 1.63,29.88 R106.2 | 2.9,43.05 v2.9,44.32 2.9,46.57 | J102.2 3.03,43.17 2.9,43.05
  Bottom 0.61: IC101.2 2.51,44.71 v2.9,44.32 | v2.9,34.67 14.08,34.67 15.85,32.89 15.85,32 16.74,31.11 20.68,31.11 J111.4
+3V3_4  (via drill 0.38)
  Top 0.61: 70.97,66.42 v70.97,64.64 | J105.2 62.08,66.67 62.34,66.42 70.97,66.42 | 70.97,66.42 70.97,68.7 | 70.97,68.7 70.97,70.99 | 70.97,70.99 70.97,76.11 R105.2 69.19,77.88 69.19,79.37 65.89,82.67 v65.89,83.18 | C102.2 70.97,70.99 | C106.2 70.97,68.7
  Bottom 0.61: IC102.2 71.11,64.5 v70.97,64.64 | J110.4 46.59,85.72 48.11,87.24 61.83,87.24 v65.89,83.18
+3V3_CP
  Bottom 0.254: C306.2 31.64,32.05 R306.2 | IC302.6 35.17,30.49 34.78,30.09
  Bottom 0.61: C306.2 C303.2 34.78,30.09
+3V3_S  (via drill 0.38)
  Top 0.203: IC205.1 21.93,12.12 C211.2
  Top 0.254: IC204.8 24.28,11.34 v23.73,10.79 | IC204.6 25.58,11.48 v26.27,10.79
  Top 0.61: J206.1 68.94,19.21 C207.2 | R202.2 51.63,17.65 | 51.63,17.65 C201.1 | IC202.VDD 19.92,18.66 19.63,18.96 C204.1 C205.1 v15.85,19.93 12.3,19.93 12.11,19.75 IC201.5 | R215.1 15.82,15.32 v15.85,15.36 | v26.27,10.79 C208.2 | R210.2 61.07,1.1 | 61.07,1.1 61.5,1.1 R208.1 | J204.1 61.32,1.35 61.07,1.1 | C203.2 21.99,10.79 | 21.99,10.79 C211.2 | v23.73,10.79 21.99,10.79 | 51.63,17.65 SJ202.1 v49.38,18.92
  Bottom 0.61: C205.1 v15.85,15.36 15.85,10.79 v23.73,10.79 v26.27,10.79 | C205.1 v15.85,19.93 | J203.4 51.16,3.17 60.56,3.17 J204.1 64.11,6.73 68.94,6.73 71.73,9.52 71.73,14.09 J206.1 66.65,19.17 49.38,19.17 | 49.38,19.17 16.07,19.17 C205.1 | v49.38,18.92 49.38,19.17
+5V
  Top 0.61: IC201.1 12.11,13.99 R207.1 | D201.C 12,14.1 R207.1 | R207.1 12.13,12.31 | 12.13,12.31 12.13,9.43 12.55,9.01 13.11,9.01 Q201.2 | C202.1 12.17,12.35 12.13,12.31
+5V_1  (via drill 0.38)
  Top 0.61: U101.1 4.39,80.16 4.42,80.13 | J109.6 27.28,62.86 v22.2,67.94 | 4.42,80.13 4.42,77.85 v4.68,77.59 | C101.1 2.94,83.43 | 2.94,83.43 R101.1 3.66,82.16 4.42,81.4 4.42,80.13 | v3.41,83.43 2.94,83.43
  Bottom 0.305: J101.VBUS 4.39,84.42 v3.41,83.43
  Bottom 0.61: v22.2,67.94 12.55,77.59 v4.68,77.59
+5V_2  (via drill 0.38)
  Top 0.61: U103.1 55.76,48.67 v55.73,48.64 | C112.1 v55.73,48.64 | v55.73,48.64 57.55,48.64 R104.1
  Bottom 0.406: 61.57,48.13 61.8,48.35 J107.VBUS
  Bottom 0.61: J108.6 55.48,42.79 55.48,47.62 55.73,47.87 | 55.73,47.87 55.99,48.13 61.57,48.13 | v55.73,48.64 55.73,47.87
+5V_3  (via drill 0.38)
  Top 0.61: U102.1 6.43,29.91 C111.1 R103.1 12.51,31.07 | J111.6 15.35,33.9 12.51,31.07 | v12.35,27.81 12.35,30.91 12.51,31.07
  Bottom 0.406: J106.VBUS 11.57,27.08 11.79,27.3
  Bottom 0.61: 11.79,27.3 11.84,27.3 v12.35,27.81
+5V_S  (via drill 0.38)
  Top 0.61: J205.2 D201.A | D201.A | D201.A v9.75,19.42 v9.76,19.43 | J201.VBUS1 31.69,8.92 v31.6,9.01 | J201.VBUS2 36.59,8.85 v36.43,9.01 | R204.2 24.24,2.95 | 24.24,2.95 R209.1 | 24.24,2.95 24.27,2.98 IC203.4 25.44,5.27 v25.51,5.2 | Q201.1 16.09,9 v16.11,9.01 | C206.1 9.8,9.81 v9.76,9.77
  Bottom 0.61: J203.6 47.86,9.01 v36.43,9.01 v31.6,9.01 25.76,9.01 | 25.25,9.01 25.76,9.01 | 24.24,9 25.74,9 25.76,9.01 | v25.51,5.2 24.24,6.47 24.24,9 | 24.24,9 16.12,9 v16.11,9.01 10.52,9.01 v9.76,9.77 v9.76,19.43
CHG
  Top 0.61: IC203.1 21.67,8.22 21.95,8.5 27.28,8.5 27.79,8 27.79,3.79 D202.C
D+
  Bottom 0.254: IC302.4 36.17,30.35 36.68,29.84 J302.A6 | J302.A6 36.68,27.3 36.94,27.05 36.94,26.16 36.68,25.9 35.79,25.9 35.41,26.28 35.41,27.3 35.67,27.55 35.67,28.57 | J302.A6
D-  (via drill 0.38)
  Top 0.254: v36.17,25.14 v36.17,26.66
  Bottom 0.254: IC302.5 35.67,30.09 36.17,29.59 J302.A7 v36.17,26.66 | v36.17,25.14 36.81,25.14 37.44,25.78 37.44,27.24 37.18,27.5 J302.B7
DTR
  Bottom 0.254: IC302.28 39.2,32.4 39.48,32.13 40.58,32.13 R308.1
  Bottom 0.406: Q301.1 41.04,32.68 R308.1
EN  (via drill 0.38)
  Top 0.254: 34.4,42.54 34.65,42.79 J305.1 | J305.1 33.51,44.45 v33.38,44.32 | J304.1 34.9,36.95 34.4,37.46 34.4,44.19 J305.1
  Bottom 0.254: R303.2 41,40.51 39.98,41.52 39.98,44.32 39.73,44.57 35.67,44.57 | Q301.3 41.65,35.32 41.76,35.43 41.76,37.42 41.22,37.97 C305.2 | 35.67,44.57 33.38,44.57 | 33.38,44.57 31.92,44.57 SW301.A | v33.38,44.32 33.38,44.57 | J301.P$1 35.68,44.56 35.67,44.57
  Bottom 0.61: R303.2 C305.2
EN_S
  Top 0.203: SW201.A 48.19,3.85 48.87,3.17 51.16,3.17 J203.1
  Top 0.61: C209.1 R210.1 55.95,2.66 54.72,2.66 53.95,1.9 J203.1
EN_S_P
  Top 0.61: IC201.3 14.01,14.24 R207.2
EN_S_P1
  Bottom 0.61: IC301.3 30.48,40.19 R301.2
GND
  Bottom 0.203: IC104.PAD3 7.39,74.97 6.96,74.54 6.96,73.68 IC104.PAD4
  pour Top: 73,0 73,90 0,90 0,0
  pour Bottom: 73,0 73,90 0,90 0,0
GPIO0  (via drill 0.38)
  Top 0.254: J304.6 33.13,39.49 33.13,42.79 32.11,43.81 32.11,46.1 v32.62,46.6 | J305.6 39.73,50.29 41.63,48.38 v41.63,47.49 41.63,42.67 39.48,40.51 39.48,36.44 42.52,33.4 v43.64,33.4
  Bottom 0.254: 40.49,45.33 40.49,43.05 41,42.54 R304.1 | 40.49,45.33 40.49,46.35 v41.63,47.49 43.29,49.14 43.29,52.45 43.1,52.64 SW302.A | v32.62,46.6 33.38,46.6 34.65,45.33 35.67,45.33 J301.P$2 40.48,45.32 40.49,45.33 | Q301.6 43.02,34.02 v43.64,33.4
I2C_SCL_S  (via drill 0.38)
  Top 0.203: IC205.6 19.93,13.59 20.17,13.84 20.17,16.12 20.93,16.89 21.44,16.89 | 26.23,14.28 IC204.4 26.23,16.84 26.27,16.89 | IC202.SCK 21.52,16.96 21.44,16.89 | 21.44,16.89 26.27,16.89 | 26.27,16.89 27.79,16.89 v27.79,17.14 | R213.2 44.81,17.65 v44.05,16.89 44.05,13.08 45.06,12.06 J203.10
  Bottom 0.203: J206.4 v44.05,16.89 28.05,16.89 v27.79,17.14
I2C_SDA_S  (via drill 0.38)
  Top 0.203: IC205.4 18.93,15.85 v18.9,15.87 | IC202.DATA 26.25,17.66 v26.27,17.65 | IC204.3 25.58,15.55 v25.25,15.87 | R214.2 45.53,15.32 45.32,15.11 v45.32,13.84
  Bottom 0.203: J206.2 66.4,14.35 65.89,13.84 52.43,13.84 | v18.9,15.87 v25.25,15.87 26.27,15.87 | 52.43,13.84 J203.9 | 52.43,13.84 v45.32,13.84 27.28,13.84 26.27,14.85 26.27,15.87 | v26.27,17.65 26.27,15.87
IN2_A
  Bottom 0.203: SJ101.2 49.64,29.33 J108.13
IN2_LED
  Bottom 0.203: SJ101.3 49.64,33.4 J108.11
IN3_A
  Bottom 0.61: SJ102.2 24.24,44.83 J111.13
IN3_LED
  Bottom 0.61: SJ102.3 24.24,40.76 J111.11
IN_DHT_S
  Top 0.203: J204.2 63.86,4.69 61.57,6.98 57.26,6.98 55.99,8.25 51.16,8.25 J203.8
  Top 0.61: J204.2 63.86,1.86 R208.2
N$1
  Top 0.61: R209.2 26.95,1.35 D202.A
N$2
  Top 0.61: R211.2 30.33,13.08 SJ203.2
N$3
  Top 0.61: R213.1 R214.1 47.39,15.62 SJ202.2
N$4
  Top 0.254: J203.5 51.16,5.71 49.13,5.71 47.86,6.98 R206.1 R205.2
N$5
  Top 0.61: SW202.A 11.96,5.69 J207.2 7.87,8.61 5.69,10.79 G201.BAT+
N$7
  Top 0.203: J202.3 59.29,11.04 59.29,17.39 58.02,18.66 SJ201.3
  Top 0.61: R202.1 SJ201.3
N$8
  Bottom 0.61: J301.P$6 31.27,49.32 30.84,48.89 30.84,43.56 31.09,43.3 32.99,43.3 D301.C
N$9  (via drill 0.38)
  Top 0.406: SJ203.1 38.97,13.58 39.48,13.08 v39.48,7.49
  Top 0.61: IC203.5 25.83,7.17 v26.27,6.73
  Bottom 0.406: v26.27,6.73 27.28,7.74 39.22,7.74 v39.48,7.49
N$10
  Top 0.203: SJ201.2 55.73,14.6 56.49,13.84 56.49,9.01 57.51,8 62.34,8 J202.1
  Top 0.61: R201.2 SJ201.2
N$11
  Top 0.61: R212.1 31.35,15.11 SJ203.3
N$13
  Bottom 0.254: R302.2 38.68,30.09 38.21,30.09 37.68,29.57 J302.A5 37.68,27.7 37.95,27.43 37.95,24.63 37.19,23.87 35.67,23.87 34.9,24.63 34.9,27.3 34.65,27.55 34.65,28.54 J302.B5
N$14
  Top 0.254: J201.A5 32.89,7.76 33.13,8 33.89,8 | 33.89,8 35.67,8 35.89,7.77 J201.B5 | R203.2 33.89,8
N$19
  Bottom 0.254: Q301.2 40.37,34.67 40.11,34.92 40.11,36.19 40.49,36.57 R307.2
N$24
  Bottom 0.254: Q301.5 42.27,34.67 41.89,34.28 41.89,33.43 R308.2
N$25
  Top 0.203: IC205.5 R215.2
  Top 0.61: R215.2 C212.1
N$33
  Bottom 0.254: IC302.11 32.87,33.9 32.36,34.41 32.36,34.7 R305.1
N$36
  Bottom 0.254: IC302.9 32.39,32.9 R306.1
PHOTO_RES  (via drill 0.38)
  Top 0.203: J202.2 60.81,9.01 58.27,9.01 v57.76,9.52 57.76,16.12 57.26,16.63 SJ201.1
  Bottom 0.203: J203.7 v57.76,9.52
RET
  cutout Bottom: 72,54.05 46,54 46,23 45.06,23 45,24 45,54 29,54 29,22 72,22 72,21 1,21 1,22 28,22 28,54 1,54 1,55 37,55 37,89 39,89 39,55 72,55
  cutout Top: 39,55 72,55 72,54 46,54 46,23 45,23 45,54 29,54 29,22 72,22 72,21 1,21 1,22 28,22 28,54 1,54 1,55 37,55 37,89 39,89
RTS  (via drill 0.38)
  Top 0.254: v40.24,37.46 40.24,36.44 41.08,35.61 43.39,35.61 v43.64,35.86
  Bottom 0.203: 39.34,34.4 39.6,34.67
  Bottom 0.254: 39.6,34.67 39.6,36.83 v40.24,37.46 | IC302.24 39.34,34.4 | v43.64,35.86 42.81,35.86 42.74,35.94
  Bottom 0.406: Q301.4 42.74,35.94 42.74,36.52 R307.1
RX  (via drill 0.38)
  Top 0.254: v38.46,46.1 39.48,46.1 39.73,45.84 J305.5 | v39.98,33.02 40.37,33.02 40.75,33.4 40.75,34.41 38.97,36.19 38.97,41.52 39.09,41.65 | 39.48,44.19 J305.5 | J305.5 39.73,42.29 39.09,41.65 | J304.5 35.67,39.49 v35.67,41.14 | v38.46,41.65 39.09,41.65
  Bottom 0.254: J301.P$3 38.24,46.32 v38.46,46.1 | v39.98,33.02 39.86,33.02 39.47,33.4 IC302.26 | v38.46,41.65 36.17,41.65 v35.67,41.14
TX  (via drill 0.38)
  Top 0.254: v38.46,47.11 37.44,47.11 37.19,46.86 J305.3 37.19,41.78 38.46,40.51 38.46,38.22 | v39.98,34.03 39.98,34.41 38.46,35.94 38.46,38.22 | J304.3 38.46,38.22
  Bottom 0.254: J301.P$4 38.25,47.32 v38.46,47.11 | v39.98,34.03 39.86,33.9 IC302.25
V_BAT  (via drill 0.38)
  Top 0.254: R206.2 v41,6.98
  Top 0.61: 16.11,6.56 C210.1 17.6,6.4 17.6,5.71 | 16.11,6.56 14.41,6.56 Q201.3 | SW202.COM 16.1,6.55 16.11,6.56 | SW202.B 17.6,5.71 | 17.6,5.71 17.85,5.46 v19.16,5.46 19.34,5.27 IC203.3
  Bottom 0.254: v41,6.98 41,4.44 39.98,3.42 21.19,3.42 v19.16,5.46
VBUS  (via drill 0.38)
  Top 0.61: v31.86,42.16 30.08,40.38 v30.08,37.21 30.08,34.67 v33.13,31.62 34.65,30.09 34.65,26.03 v34.14,25.52
  Bottom 0.254: IC302.7 33.43,31.31 v33.13,31.62 33.13,32.38 33.15,32.4 IC302.8
  Bottom 0.406: J302.VBUS1 38.88,27.72 38.71,27.55 38.71,25.52 | J302.VBUS2 33.98,27.46 34.14,27.3 v34.14,25.52
  Bottom 0.61: IC301.1 30.48,38.29 R301.1 30.08,38.18 v30.08,37.21 | 42.49,25.52 38.71,25.52 38.71,24.38 37.44,23.11 35.41,23.11 34.14,24.38 v34.14,25.52 | 42.49,25.52 C302.1 42.49,27.77 J303.2 | 42.49,25.52 C301.1 | D301.A 31.73,42.03 v31.86,42.16
VCON  (via drill 0.38)
  Top 0.61: 34.52,50.67 J305.2 33.25,50.8 v33.13,50.92 | J304.2 32.5,34.28 35.16,31.62 40.77,31.62 41.63,32.48 44.17,32.48 44.56,32.86 44.56,37.46 | 44.56,37.46 44.56,42.54 43.79,43.3 43.79,48.38 v42.02,50.16 | D302.C 44.43,37.34 44.56,37.46
  Bottom 0.61: v33.13,50.92 33.73,50.32 J301.P$7 41.86,50.32 v42.02,50.16

## Text on the board
tPlace: EN GD 34 35 23 16 26 18 25 04 13 15 27 | EN GD SQ FR SD LD _A _C _E R1 B1 G2 CK | PG 3V 5V DH SC SN _B _D OE G1 R2 B2 LT | 0 3V 5V 17 22 02 05 19 33 12 14 21 32 | 3V | G | 0 | RX | TX | RST | RST | RX | TX | 0 | G | 3V | 0 3V 5V 18 02 04 33 35 21 15 13 11 09 | PG 3V 5V DH SC SN _B _D OE G1 R2 B2 LT | EN GD SQ FR SD LD _A _C _E R1 B1 G2 CK | EN GD 37 17 01 03 34 36 26 16 14 12 10 | 3V | 0 | 3V | G | 0 | EN GD 02 01 05 04 04 10 | EN GD SQ FR SD LD _A _C | PG 3V 5V DH SC SN _B _D | 09 3V 5V 00 06 03 08 07 | RX | TX | RST | RST | TX | RX | RST | TX | RX | 0 | G | 3V | 09 3V 5V 00 06 03 08 07 | PG 3V 5V DH SC SN _B _D | EN GD SQ FR SD LD _A _C | EN GD 02 01 05 04 04 10 | + | + | SCL | VCC | - | + | - | + | VCC | G | - | PG 3V 5V DH SC | EN GD SQ FR SD